# Altium schematic sheet 05 - CAN_RS485.SchDoc
size A4
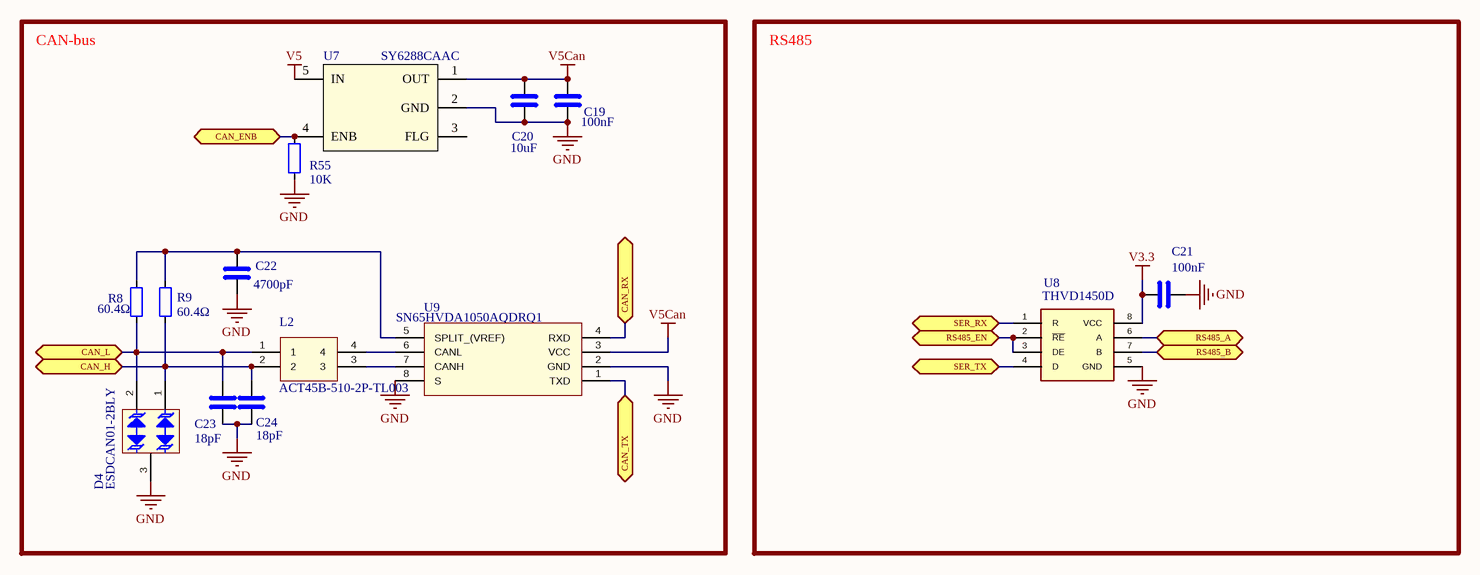
[diagram p0: 05 - CAN_RS485.SchDoc]

## Parts
C19  100nF  [CAP_0603]
C20  10uF  [CAP_0805]
C21  100nF  [CAP_0603]
C22  4700pF  [CAP_0603]
C23  18pF  [CAP_0603]
C24  18pF  [CAP_0603]
D4  ESDCAN01-2BLY  [SOT95P255X150-3N]
L2  ACT45B-510-2P-TL003  [ACT45B1012PTL003]
R8  60.4Ω  [RES_0603]
R9  60.4Ω  [RES_0603]
R55  value 10K  [RES_0603]  (hidden comment: 10K 1%)
U7  SY6288CAAC  [SOT95P285X145-5N]
U8  THVD1450D  [SOIC127P600]
U9  SN65HVDA1050AQDRQ1  [SOIC127P600]

## Blocks framed on the sheet
CAN-bus: C19 C20 C22-C24 D4 L2 R8 R9 R55 U7 U9
RS485: C21 U8

## Ports
CAN_ENB (bidir), CAN_H (bidir), CAN_L (bidir), CAN_RX (bidir), CAN_TX (bidir), RS485_A (bidir), RS485_B (bidir), RS485_EN (bidir), SER_RX (bidir), SER_TX (bidir)

## Nets
GND: C19.2 C20.2 C21.2 C22.2 C23.2 C24.2 D4.3 R55.2 U7.2(GND) U8.5(GND) U9.2(GND) U9.8(S)
V3.3: C21.1 U8.8(VCC)
V5: U7.5(IN)
V5Can: C19.1 C20.1 U7.1(OUT) U9.3(VCC)
CAN_ENB: R55.1 U7.4(ENB) ; port CAN_ENB
CAN_H: C24.1 D4.1 L2.2 R9.1 ; port CAN_H
CAN_L: C23.1 D4.2 L2.1 R8.1 ; port CAN_L
CAN_RX: U9.4(RXD) ; port CAN_RX
CAN_TX: U9.1(TXD) ; port CAN_TX
RS485_A: U8.6(A) ; port RS485_A
RS485_B: U8.7(B) ; port RS485_B
RS485_EN: U8.2(~{RE}) U8.3(DE) ; port RS485_EN
SER_RX: U8.1(R) ; port SER_RX
SER_TX: U8.4(D) ; port SER_TX
NetC22_1: C22.1 R8.2 R9.2 U9.5(SPLIT_(VREF))
NetL2_3: L2.3 U9.7(CANH)
NetL2_4: L2.4 U9.6(CANL)

Not connected (* = marked no-connect by the designer): U7 3(FLG)

## Notes on the sheet
- Title
- Size:
- Date:
- A4
- Number:
- Time:
- Revision:
- Sheet
- of
- File:

## Library data of the parts
C19-C22 = C
  C19 C21: pdf: https://www.lcsc.com/datasheet/lcsc_datasheet_2501031500_HRE-CGA0603X7R104K500JT_C6119867.pdf; LCSC PART: C6119867; lcsc link: https://www.lcsc.com/product-detail/Multilayer-Ceramic-Capacitors-MLCC-SMD-SMT_HRE-CGA0603X7R104K500JT_C6119867.html?s_z=n_100nF; JLCPCB: C6119867; Value: 100nF
  C20: Value: 10uF; lcsc link: https://www.lcsc.com/product-detail/Multilayer-Ceramic-Capacitors-MLCC-SMD-SMT_Samsung-Electro-Mechanics-CL21A106KOQNNNE_C1713.html?s_z=n_C1713; LCSC PART: C1713; JLCPCB: C1713
  C22: JLCPCB: C7503499; Value: 4700pF; lcsc link: https://www.lcsc.com/product-detail/Multilayer-Ceramic-Capacitors-MLCC-SMD-SMT_HRE-CGA0603X7R472K500JT_C7503499.html; LCSC PART: C7503499
C23 C24 = C: 50V 18pF X7R ±10% 0603 Multilayer Ceramic Capacitors MLCC - SMD/SMT ROHS; Value: 18pF; Footprint: Capacitor_SMD:C_0603_1608Metric; LCSC PART: C6119867; lcsc link: https://www.lcsc.com/product-detail/Multilayer-Ceramic-Capacitors-MLCC-SMD-SMT_HRE-CGA0603X7R104K500JT_C6119867.html; JLCPCB: C6119867
D4 = ESDCAN01-2BLY: 5.5A@8/20us 230W 40V 25V 24V SOT-23 ESD and Surge Protection (TVS/ESD) ROHS; PAGE: DPESDCAN01; JLCPCB: C1976606; Value: ESDCAN01-2BLY; LCSC PART: C1976606; lcsc link: https://www.lcsc.com/product-detail/ESD-and-Surge-Protection-TVS-ESD_STMicroelectronics-ESDCAN01-2BLY_C1976606.html?s_z=n_C1976606; pdf: https://www.lcsc.com/datasheet/lcsc_datasheet_2410010332_STMicroelectronics-ESDCAN01-2BLY_C1976606.pdf
L2 = ACT45B-510-2P-TL003: 51uH@100kHz 2.8kΩ@10MHz 1Ω 2 SMD,4.5x3.2mm Common Mode Filters ROHS; PAGE: L51UHACT45B; JLCPCB: C76584; Value: ACT45B-510-2P-TL003; LCSC PART: C76584; lcsc link: https://www.lcsc.com/product-detail/Common-Mode-Filters_TDK-ACT45B-510-2P-TL003_C76584.html?s_z=n_C76584; pdf: https://www.lcsc.com/datasheet/lcsc_datasheet_2412231058_TDK-ACT45B-510-2P-TL003_C76584.pdf
R8 R9 = R: 100mW Thick Film Resistors 75V ±100ppm/℃ ±1% 60.4Ω 0603 Chip Resistor - Surface Mount ROHS; Value: 60.4Ω; JLCPCB: C23090; LCSC PART: C23090; lcsc link: https://www.lcsc.com/product-detail/Chip-Resistor-Surface-Mount_UNI-ROYAL-Uniroyal-Elec-0603WAF604JT5E_C23090.html?s_z=n_60.4R
R55 = R: JLCPCB: C25804; LCSC PART: C25804; lcsc link: https://www.lcsc.com/product-detail/Chip-Resistor-Surface-Mount_UNI-ROYAL-Uniroyal-Elec-0603WAF1002T5E_C25804.html
U7 = AP22802A: 2.5V~5.5V 60mΩ Active High 2A 1 Load Switch SOT-23-5 Power Distribution Switches ROHS; Value: SY6288CAAC; JLCPCB: C111830; LCSC PART: C111830; lcsc link: https://www.lcsc.com/product-detail/Power-Distribution-Switches_Silergy-Corp-SY6288CAAC_C111830.html; pdf: https://www.lcsc.com/datasheet/lcsc_datasheet_1810010210_Silergy-Corp-SY6288CAAC_C111830.pdf
U9 = SN65HVDA1050AQDRQ1: PAGE: ICSN65HVDA1050A; JLCPCB: C115764; Value: SN65HVDA1050AQDRQ1; Footprint: SN65HVDA1050AQDRQ1:SOIC127P600X175-8N; pdf: https://www.lcsc.com/datasheet/lcsc_datasheet_2410010301_Texas-Instruments-SN65HVDA1050AQDRQ1_C115764.pdf; LCSC PART: C115764; lcsc link: https://www.lcsc.com/product-detail/CAN-Transceivers_Texas-Instruments-SN65HVDA1050AQDRQ1_C115764.html?s_z=n_C115764
U8 = THVD1450D: JLCPCB: C2671361; Value: THVD1450D; Footprint: THVD1450D:SOIC127P599X175-8N; LCSC PART: C2671361; lcsc link: https://www.lcsc.com/product-detail/RS-485-RS-422-ICs_Texas-Instruments-THVD1450DR_C2671361.html?s_z=n_C2671361; pdf: https://www.ti.com/lit/ds/symlink/thvd1450.pdf?HQS=dis-dk-null-digikeymode-dsf-pf-null-wwe&ts=1737388582157&ref_url=https%253A%252F%252Fwww.ti.com%252Fgeneral%252Fdocs%252Fsuppproductinfo.tsp%253FdistId%253D10%2526gotoUrl%253Dhttps%253A%252F%252Fwww.ti.com%252Flit%252Fgpn%252Fthvd1450